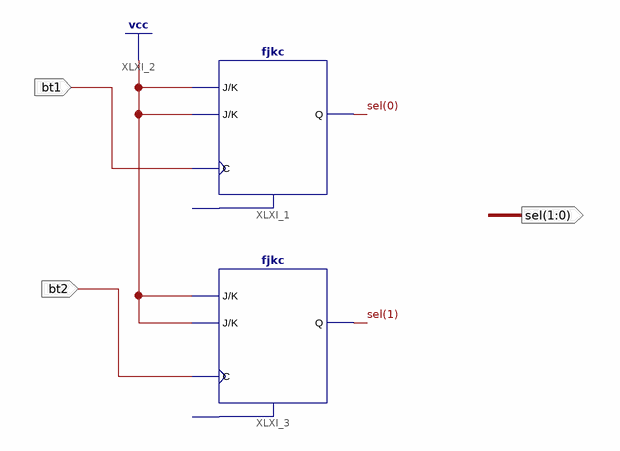
[diagram p0: schematic sheet 1]
// Xilinx ISE schematic sel_2btn_4mode.sch (spartan6) as structural Verilog: 2 symbols, 3 ports
module sel_2btn_4mode (
  input  bt1,
  input  bt2,
  output [1:0] sel
);

  fjkc XLXI_1 (.C(bt1), .J(1'b1), .K(1'b1), .Q(sel[0]));  // open: CLR
  fjkc XLXI_3 (.C(bt2), .J(1'b1), .K(1'b1), .Q(sel[1]));  // open: CLR
endmodule
